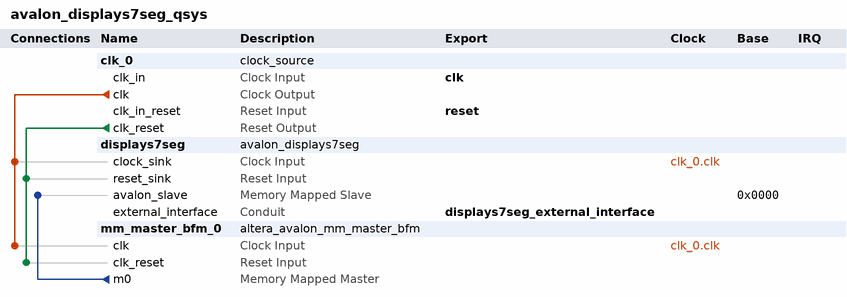
[diagram p0: system contents]
# Platform Designer (Qsys) system avalon_displays7seg_qsys, Cyclone IV E EP4CE115F29C7
# Parameters at their usual value, and those the tool derives, are not listed.
package require -exact qsys 17.1
create_system avalon_displays7seg_qsys
set_project_property DEVICE_FAMILY {Cyclone IV E}
set_project_property DEVICE EP4CE115F29C7

add_instance clk_0 clock_source 17.1
set_instance_parameter_value clk_0 clockFrequency 50000000

add_instance displays7seg avalon_displays7seg 1.0
set_instance_parameter_value displays7seg invert 1

add_instance mm_master_bfm_0 altera_avalon_mm_master_bfm 17.1
set_instance_parameter_value mm_master_bfm_0 ADDRESS_UNITS WORDS
set_instance_parameter_value mm_master_bfm_0 AV_ADDRESS_W 3
set_instance_parameter_value mm_master_bfm_0 AV_ALWAYS_BURST_MAX_BURST 0
set_instance_parameter_value mm_master_bfm_0 AV_BURSTCOUNT_W 1
set_instance_parameter_value mm_master_bfm_0 AV_BURST_BNDR_ONLY 0
set_instance_parameter_value mm_master_bfm_0 AV_BURST_LINEWRAP 0
set_instance_parameter_value mm_master_bfm_0 AV_CONSTANT_BURST_BEHAVIOR 0
set_instance_parameter_value mm_master_bfm_0 AV_FIX_READ_LATENCY 0
set_instance_parameter_value mm_master_bfm_0 AV_MAX_PENDING_WRITES 0
set_instance_parameter_value mm_master_bfm_0 AV_NUMSYMBOLS 4
set_instance_parameter_value mm_master_bfm_0 AV_READRESPONSE_W 8
set_instance_parameter_value mm_master_bfm_0 AV_READ_WAIT_TIME 1
set_instance_parameter_value mm_master_bfm_0 AV_WRITERESPONSE_W 8
set_instance_parameter_value mm_master_bfm_0 USE_BURSTCOUNT 0
set_instance_parameter_value mm_master_bfm_0 USE_BYTE_ENABLE 0
set_instance_parameter_value mm_master_bfm_0 USE_READ 1
set_instance_parameter_value mm_master_bfm_0 USE_READ_DATA 1
set_instance_parameter_value mm_master_bfm_0 USE_READ_DATA_VALID 0
set_instance_parameter_value mm_master_bfm_0 USE_WAIT_REQUEST 1
set_instance_parameter_value mm_master_bfm_0 VHDL_ID 0

# connections
add_connection clk_0.clk displays7seg.clock_sink clock
add_connection clk_0.clk mm_master_bfm_0.clk clock
add_connection clk_0.clk_reset displays7seg.reset_sink reset
add_connection clk_0.clk_reset mm_master_bfm_0.clk_reset reset
add_connection mm_master_bfm_0.m0 displays7seg.avalon_slave avalon
set_connection_parameter_value mm_master_bfm_0.m0/displays7seg.avalon_slave baseAddress 0x0000

# exported interfaces
add_interface clk clock sink
set_interface_property clk EXPORT_OF clk_0.clk_in
add_interface displays7seg_external_interface conduit end
set_interface_property displays7seg_external_interface EXPORT_OF displays7seg.external_interface
add_interface reset reset sink
set_interface_property reset EXPORT_OF clk_0.clk_in_reset

set_interconnect_requirement {$system} qsys_mm.clockCrossingAdapter HANDSHAKE
set_interconnect_requirement {$system} qsys_mm.enableEccProtection FALSE
set_interconnect_requirement {$system} qsys_mm.insertDefaultSlave FALSE
set_interconnect_requirement {$system} qsys_mm.maxAdditionalLatency 1

save_system avalon_displays7seg_qsys.qsys
